# EAGLE design EasyFlybackRev2 (EAGLE 9.6.2)
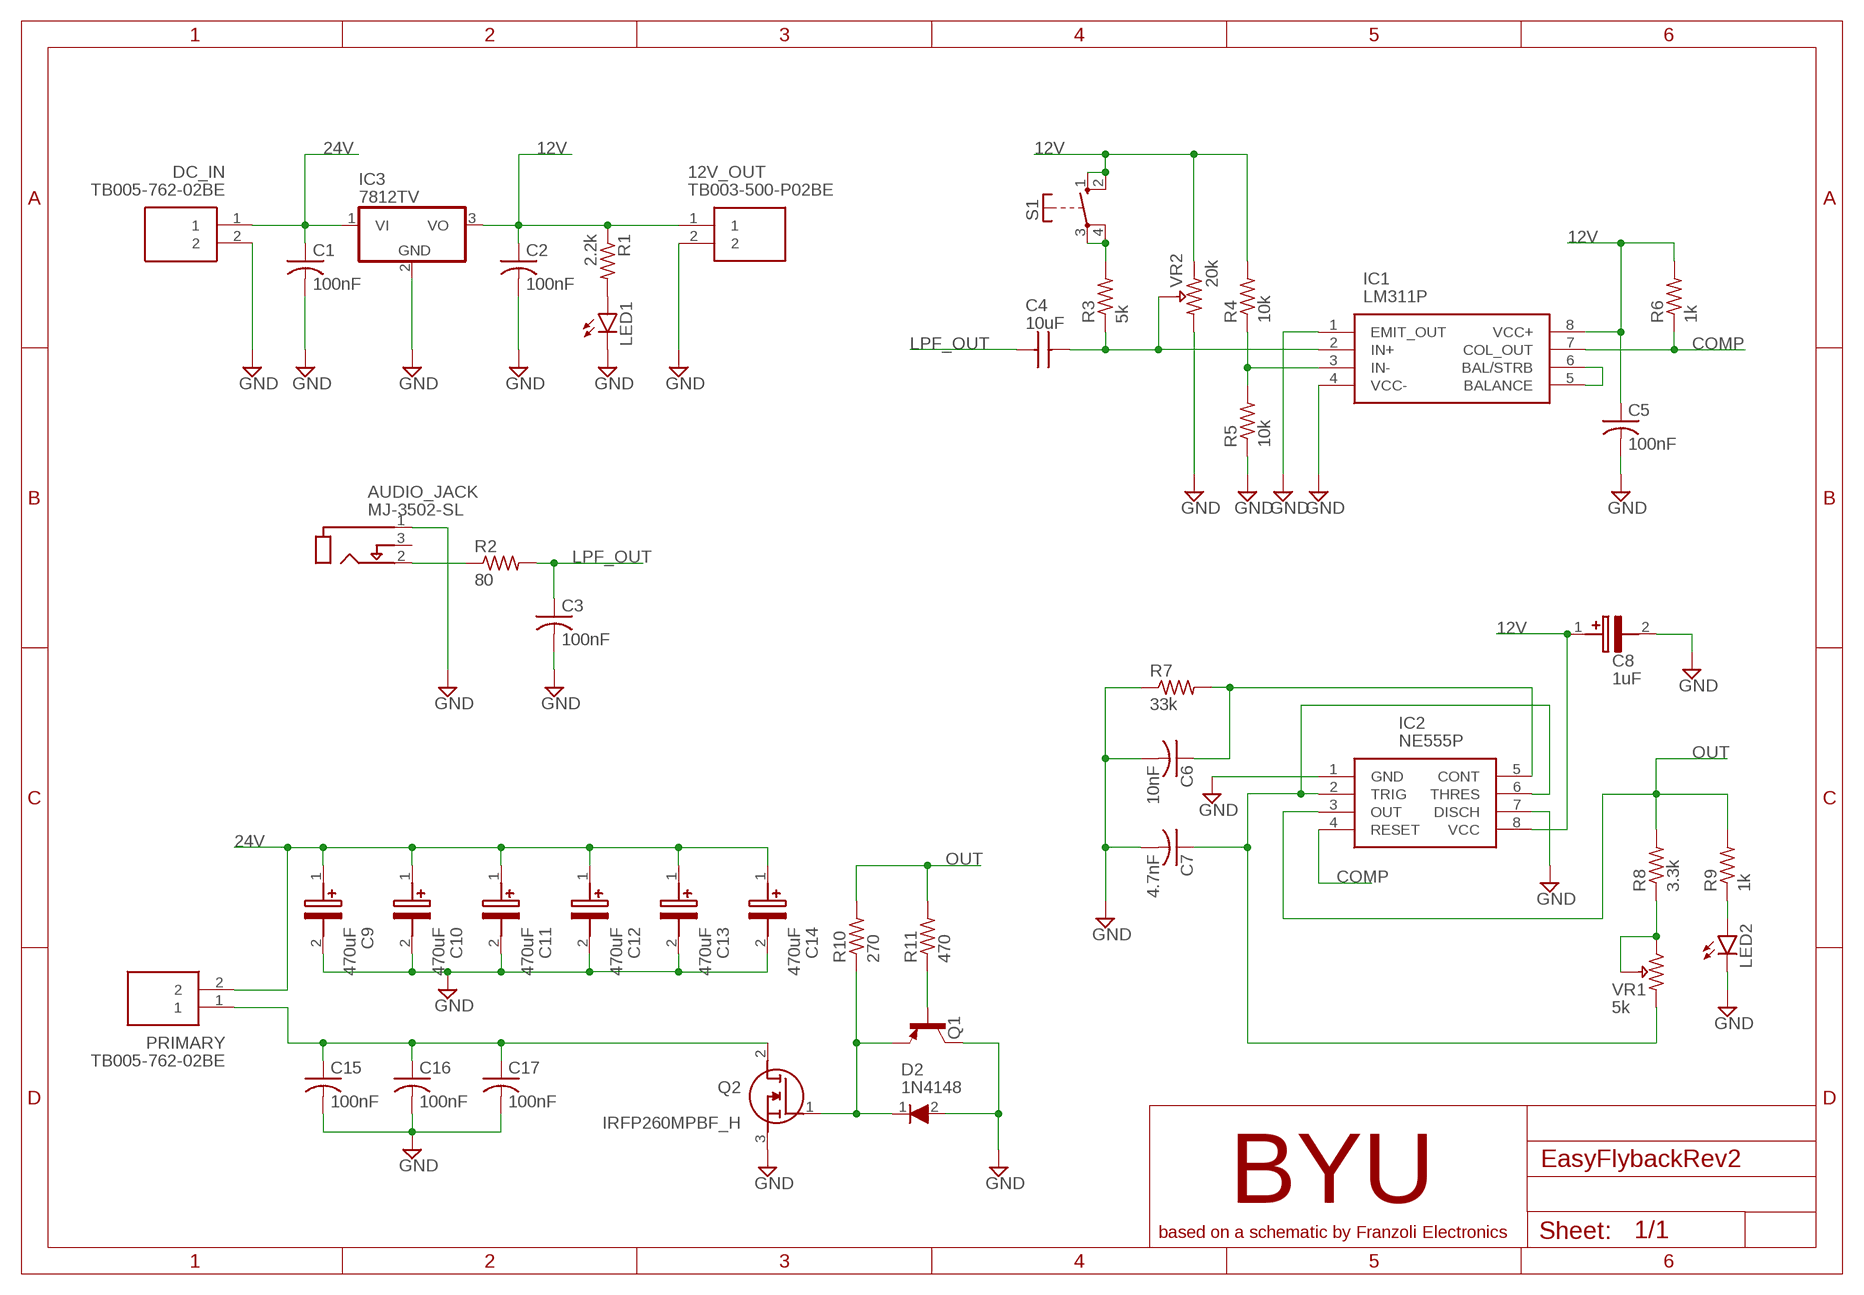
[diagram p0: schematic, sheet 1]

## Parts
12V_OUT  TB003-500-P02BE  [SHDR2W100P0X500_1X2_1000X780X1]
AUDIO_JACK  MJ-3502-SL  [MJ3502-SL]
C1  100nF  C-US025-024X044  [C025-024X044]
C2  100nF  C-US025-024X044  [C025-024X044]
C3  100nF  C-US025-024X044  [C025-024X044]
C4  10uF  RDEC71H106K3K1H03B  [RCE7U2J103J3K1H03B]
C5  100nF  C-US025-024X044  [C025-024X044]
C6  10nF  C-US025-024X044  [C025-024X044]
C7  4.7nF  C-US025-024X044  [C025-024X044]
C8  1uF  TAP105K035SCS  [TAP105K035SCS]
C9  470uF  ECA-1VM471B  [CAPPRD500W65D1000H1700]
C10  470uF  ECA-1VM471B  [CAPPRD500W65D1000H1700]
C11  470uF  ECA-1VM471B  [CAPPRD500W65D1000H1700]
C12  470uF  ECA-1VM471B  [CAPPRD500W65D1000H1700]
C13  470uF  ECA-1VM471B  [CAPPRD500W65D1000H1700]
C14  470uF  ECA-1VM471B  [CAPPRD500W65D1000H1700]
C15  100nF  MKP1G031004D00KSSD  [MKP1G031004D00KSSD]
C16  100nF  MKP1G031004D00KSSD  [MKP1G031004D00KSSD]
C17  100nF  MKP1G031004D00KSSD  [MKP1G031004D00KSSD]
D2  1N4148  [DIOAD1068W53L380D172]
DC_IN  TB005-762-02BE  [TB00576202BE]
IC1  LM311P  [DIP794W53P254L959H508Q8N]
IC2  NE555P  [DIP794W53P254L959H508Q8N]
IC3  7812TV  [TO220V]
LED1  LED5MM  [LED5MM]
LED2  LED5MM  [LED5MM]
PRIMARY  TB005-762-02BE  [TB00576202BE]
Q1  -PNP-TO92-E1  [TO92-E1]
Q2  IRFP260MPBF_H  [TO545P520X1594X2550-3P_H]
R1  2.2k  R-US_0207/10  [0207/10]
R2  80  R-US_0207/10  [0207/10]
R3  5k  R-US_0207/10  [0207/10]
R4  10k  R-US_0207/10  [0207/10]
R5  10k  R-US_0207/10  [0207/10]
R6  1k  R-US_0207/10  [0207/10]
R7  33k  R-US_0207/10  [0207/10]
R8  3.3k  R-US_0207/10  [0207/10]
R9  1k  R-US_0207/10  [0207/10]
R10  270  R-US_0207/10  [0207/10]
R11  470  R-US_0207/10  [0207/10]
S1  DTE6K  [DTE6K]
VR1  5k  PV36W502C01B00  [PV36W502C01B00]
VR2  20k  PV36W502C01B00  [PV36W502C01B00]

## Nets
12V: 12V_OUT.1 C2.1 C5.1 C8.1(+) IC1.8(VCC+) IC2.8(VCC) IC3.3(VO) R1.1 R4.2 R6.2 S1.1(S) S1.2(S) VR2.1(CCW)
24V: C1.1 C9.1(+) C10.1(+) C11.1(+) C12.1(+) C13.1(+) C14.1(+) DC_IN.1 IC3.1(VI) PRIMARY.2
COMP: IC1.7(COL_OUT) IC2.4(RESET) R6.1
GND: 12V_OUT.2 AUDIO_JACK.1 C1.2 C2.2 C3.2 C5.2 C6.2 C7.2 C8.2(-) C9.2(-) C10.2(-) C11.2(-) C12.2(-) C13.2(-) C14.2(-) C15.P$2 C16.P$2 C17.P$2 D2.2(A) DC_IN.2 IC1.1(EMIT_OUT) IC1.4(VCC-) IC2.1(GND) IC2.7(DISCH) IC3.2(GND) LED1.K(C) LED2.K(C) Q1.1(C) Q2.3(S) R5.1 R7.1 VR2.3(CW)
LPF_OUT: C3.1 C4.1 R2.2
N$1: C15.P$1 C16.P$1 C17.P$1 PRIMARY.1 Q2.2(D)
N$2: LED1.A R1.2
N$4: AUDIO_JACK.2 R2.1
N$6: D2.1(K) Q1.3(E) Q2.1(G) R10.1
N$7: R3.2 S1.3(P) S1.4(P)
N$8: IC1.5(BALANCE) IC1.6(BAL/STRB)
N$9: Q1.2(B) R11.1
N$10: C7.1 IC2.2(TRIG) IC2.6(THRES) VR1.3(CW)
N$11: R8.1 VR1.1(CCW) VR1.2(WIPER)
N$12: C6.1 IC2.5(CONT) R7.2
N$13: LED2.A R9.1
N$14: IC1.3(IN-) R4.1 R5.2
N$15: C4.2 IC1.2(IN+) R3.1 VR2.2(WIPER)
OUT: IC2.3(OUT) R8.2 R9.2 R10.2 R11.2
Unconnected: AUDIO_JACK.3

## Notes on the sheet
- BYU
- based on a schematic by Franzoli Electronics

## Library data of the parts
12V_OUT = IMMERSE:TB003-500-P02BE: Fixed Terminal Blocks screw type, 5.00 , horizontal, 2 poles, CUI Blue, Philip's head screw, PCB mount Source: Datasheet <https://datasheet.datasheetarchive.com/originals/distributors/Datasheets_SAMA/d07efe5b59076245584f142a7e2a35cb.pdf>; DESCRIPTION: Fixed Terminal Blocks screw type, 5.00 , horizontal, 2 poles, CUI Blue, Philip's head screw, PCB mount; HEIGHT: 10.3mm; MANUFACTURER_NAME: CUI Inc.; MANUFACTURER_PART_NUMBER: TB003-500-P02BE; MOUSER_PART_NUMBER: 490-TB003-500-P02BE; MOUSER_PRICE-STOCK: https://www.mouser.co.uk/ProductDetail/CUI-Devices/TB003-500-P02BE?qs=vLWxofP3U2yAT9CFQJ%2FCaw%3D%3D
AUDIO_JACK = IMMERSE:MJ-3502-SL: Phone Connectors Audio Jacks Source: Datasheet <https://www.cuidevices.com/product/resource/digikeypdf/mj-3502.pdf>; SPICEPREFIX: J
C1-C3 C5-C7 = rcl:C-US: CAPACITOR, American symbol; SPICEPREFIX: C
C4 = IMMERSE:RDEC71H106K3K1H03B: Multilayer Ceramic Capacitors MLCC - Leaded 10UF 50V 10% 5MM Source: Datasheet <https://psearch.en.murata.com/capacitor/product/RDEC71H106K3K1H03B.html>; DESCRIPTION: Multilayer Ceramic Capacitors MLCC - Leaded 10UF 50V 10% 5MM; HEIGHT: 7.5mm; MANUFACTURER_NAME: Murata Electronics; MANUFACTURER_PART_NUMBER: RDEC71H106K3K1H03B; MOUSER_PART_NUMBER: 81-RDEC71H106K3K1H3B; MOUSER_PRICE-STOCK: https://www.mouser.co.uk/ProductDetail/Murata-Electronics/RDEC71H106K3K1H03B?qs=hNud%2FORuBR3znCHotF4tAw%3D%3D
C8 = IMMERSE:TAP105K035SCS: AVX Tantalum Capacitor 1uF 35V dc Solid +/-10% Tolerance TAP Series Source: Datasheet <https://componentsearchengine.com/Datasheets/1/TAP105K035SCS.pdf>; DESCRIPTION: AVX Tantalum Capacitor 1uF 35V dc Solid +/-10% Tolerance TAP Series; HEIGHT: 7mm; MANUFACTURER_NAME: AVX; MANUFACTURER_PART_NUMBER: TAP105K035SCS; MOUSER_PART_NUMBER: 581-TAP105K035SCS; MOUSER_PRICE-STOCK: https://www.mouser.com/Search/Refine.aspx?Keyword=581-TAP105K035SCS
C9-C14 = IMMERSE:ECA-1VM471B: Aluminum Electrolytic Capacitors - Leaded 470UF 35V ELECT M RADIAL Source: Datasheet <http://industrial.panasonic.com/cdbs/www-data/pdf/RDF0000/ABA0000C1218.pdf>; DESCRIPTION: Aluminum Electrolytic Capacitors - Leaded 470UF 35V ELECT M RADIAL; HEIGHT: 17mm; MANUFACTURER_NAME: Panasonic; MANUFACTURER_PART_NUMBER: ECA-1VM471B; MOUSER_PART_NUMBER: 667-ECA-1VM471B; MOUSER_PRICE-STOCK: https://www.mouser.co.uk/ProductDetail/Panasonic/ECA-1VM471B?qs=HDhZcL5REiYtj3pihfsTHg%3D%3D
C15-C17 = IMMERSE:MKP1G031004D00KSSD
D2 = IMMERSE:1N4148: Small Signal Diode, 100V 0.3A 2-Pin DO35 Source: Datasheet; DESCRIPTION: Small Signal Diode, 100V 0.3A 2-Pin DO35; HEIGHT: mm; MANUFACTURER_NAME: onsemi; MANUFACTURER_PART_NUMBER: 1N4148; MOUSER_PART_NUMBER: 512-1N4148; MOUSER_PRICE-STOCK: https://www.mouser.co.uk/ProductDetail/ON-Semiconductor-Fairchild/1N4148?qs=i4Fj9T%2FoRm8RMUhj5DeFQg%3D%3D
DC_IN PRIMARY = IMMERSE:TB005-762-02BE: Fixed Terminal Blocks screw type, 7.62 , horizontal, 2 poles, CUI Blue, slotted screw, PCB mount Source: Datasheet <https://componentsearchengine.com/Datasheets/1/TB005-762-02BE.pdf>; DESCRIPTION: Fixed Terminal Blocks screw type, 7.62 , horizontal, 2 poles, CUI Blue, slotted screw, PCB mount; HEIGHT: 21.7mm; MANUFACTURER_NAME: CUI Inc.; MANUFACTURER_PART_NUMBER: TB005-762-02BE; MOUSER_PART_NUMBER: 490-TB005-762-02BE; MOUSER_PRICE-STOCK: https://www.mouser.co.uk/ProductDetail/CUI-Devices/TB005-762-02BE?qs=vLWxofP3U2zXv1H2wuShow%3D%3D
IC1 = IMMERSE:LM311P: Single comparator,LM311P 165ns DIP8 LM311P, Comparator Open Collector/Emitter 0.165us 12 V, 15 V, 18 V, 24 V, 28 V, 5 V, 9 V 8-Pin PDIP Source: Datasheet <http://www.ti.com/lit/ds/symlink/lm311.pdf>; DESCRIPTION: Single comparator,LM311P 165ns DIP8 LM311P, Comparator Open Collector/Emitter 0.165us 12 V, 15 V, 18 V, 24 V, 28 V, 5 V, 9 V 8-Pin PDIP; HEIGHT: 5.08mm; MANUFACTURER_NAME: Texas Instruments; MANUFACTURER_PART_NUMBER: LM311P; MOUSER_PART_NUMBER: 595-LM311P; MOUSER_PRICE-STOCK: https://www.mouser.co.uk/ProductDetail/Texas-Instruments/LM311P?qs=0OT4q4QBUTKsKDe9sMZxLw%3D%3D
IC2 = IMMERSE:NE555P: Precision timer,NE555P 0.5MHz DIL8 Texas Instruments NE555P, Precision Timer, 4.5 16 V, 8-Pin PDIP Source: Datasheet <http://www.ti.com/lit/ds/symlink/ne555.pdf>; DESCRIPTION: Precision timer,NE555P 0.5MHz DIL8 Texas Instruments NE555P, Precision Timer, 4.5 16 V, 8-Pin PDIP; HEIGHT: 5.08mm; MANUFACTURER_NAME: Texas Instruments; MANUFACTURER_PART_NUMBER: NE555P; MOUSER_PART_NUMBER: 595-NE555P; MOUSER_PRICE-STOCK: https://www.mouser.co.uk/ProductDetail/Texas-Instruments/NE555P?qs=rkhjVJ6%2F3EIf4CWgjIKuKQ%3D%3D
IC3 = linear:78*: Positive VOLTAGE REGULATOR Source: http://cache.national.com/ds/LM/LM78L05.pdf http://www.fairchildsemi.com/ds/LM/LM7805.pdf
LED1 LED2 = led:LED: LED OSRAM: - CHIPLED LG R971, LG N971, LY N971, LG Q971, LY Q971, LO R971, LY R971 LH N974, LH R974 LS Q976, LO Q976, LY Q976 LO Q996 - Hyper CHIPLED LW Q18S LB Q993, LB Q99A, LB R99A - SideLED LS A670, LO A670, LY A670, LG A670, LP A670 LB A673, LV A673, LT A673, LW A673 LH A674 LY A675 LS A676, LA A676, LO A676, LY A676, LW A676 LS A679, LY A679, LG A679 - Hyper Micro SIDELED® LS Y876, LA Y876, LO Y876, LY Y876 LT Y87S - SmartLED LW L88C, LW L88S LB L89C, LB L89S, LG L890 LS L89K, LO L89K, LY L89K LS L896, LA L896, LO L896, LY L896 - TOPLED LS T670, LO T670, LY T670, LG T670, LP T670 LSG T670, LSP T670, LSY T670, LOP T670, LYG T670 LG T671, LOG T671, LSG T671 LB T673, LV T673, LT T673, LW T673 LH T674 LS T676, LA T676, LO T676, LY T676, LB T676, LH T676, LSB T676, LW T676 LB T67C, LV T67C, LT T67C, LS T67K, LO T67K, LY T67K, LW E67C LS E67B, LA E67B, LO E67B, LY E67B, LB E67C, LV E67C, LT E67C LW T67C LS T679, LY T679, LG T679 LS T770, LO T770, LY T770, LG T770, LP T770 LB T773, LV T773, LT T773, LW T773 LH T774 LS E675, LA E675, LY E675, LS T675 LS T776, LA T776, LO T776, LY T776, LB T776 LHGB T686 LT T68C, LB T68C - Hyper Mini TOPLED® LB M676 - Mini TOPLED Santana® LG M470 LS M47K, LO M47K, LY M47K Source: http://www.osram.convergy.de LUXEON: - LUMILED® LXK2-PW12-R00, LXK2-PW12-S00, LXK2-PW14-U00, LXK2-PW14-V00 LXK2-PM12-R00, LXK2-PM12-S00, LXK2-PM14-U00 LXK2-PE12-Q00, LXK2-PE12-R00, LXK2-PE12-S00, LXK2-PE14-T00, LXK2-PE14-U00 LXK2-PB12-K00, LXK2-PB12-L00, LXK2-PB12-M00, LXK2-PB14-N00, LXK2-PB14-P00, LXK2-PB14-Q00 LXK2-PR12-L00, LXK2-PR12-M00, LXK2-PR14-Q00, LXK2-PR14-R00 LXK2-PD12-Q00, LXK2-PD12-R00, LXK2-PD12-S00 LXK2-PH12-R00, LXK2-PH12-S00 LXK2-PL12-P00, LXK2-PL12-Q00, LXK2-PL12-R00 Source: www.luxeon.com KINGBRIGHT: KA-3528ASYC Source: www.kingbright.com
Q1 = transistor:*-PNP-: PNP Transistror
Q2 = IMMERSE:IRFP260MPBF_H: Infineon IRFP260MPBF N-Channel MOSFET, 50 A, 200 V HEXFET, 3-Pin TO-247AC Source: Datasheet <https://www.infineon.com/dgdl/irfp260mpbf.pdf?fileId=5546d462533600a40153562894e91fe0>; DESCRIPTION: Infineon IRFP260MPBF N-Channel MOSFET, 50 A, 200 V HEXFET, 3-Pin TO-247AC; HEIGHT: 5.2mm; MANUFACTURER_NAME: Infineon; MANUFACTURER_PART_NUMBER: IRFP260MPBF; MOUSER_PART_NUMBER: 942-IRFP260MPBF; MOUSER_PRICE-STOCK: https://www.mouser.co.uk/ProductDetail/Infineon-IR/IRFP260MPBF?qs=9%252BKlkBgLFf3VoUn7jHVwig%3D%3D
R1-R11 = rcl:R-US_: RESISTOR, American symbol; SPICEPREFIX: R
S1 = switch-misc:DT: ITT SWITCH
VR1 VR2 = IMMERSE:PV36W502C01B00: Res Cermet Trimmer 5K Ohm 10% 0.5W(1/2W) 25(Elec)Turns 2.19mm (9.53 X 4.83 X 10.55mm) Pin Thru-Hole Tube Source: Datasheet; DESCRIPTION: Res Cermet Trimmer 5K Ohm 10% 0.5W(1/2W) 25(Elec)Turns 2.19mm (9.53 X 4.83 X 10.55mm) Pin Thru-Hole Tube; HEIGHT: 11.55mm; MANUFACTURER_NAME: Bourns; MANUFACTURER_PART_NUMBER: PV36W502C01B00; MOUSER_PART_NUMBER: 81-PV36W502C01B00; MOUSER_PRICE-STOCK: https://www.mouser.co.uk/ProductDetail/Bourns/PV36W502C01B00?qs=BqPwLKJeIrffwfpi4cR%2Fyg%3D%3D

## Board
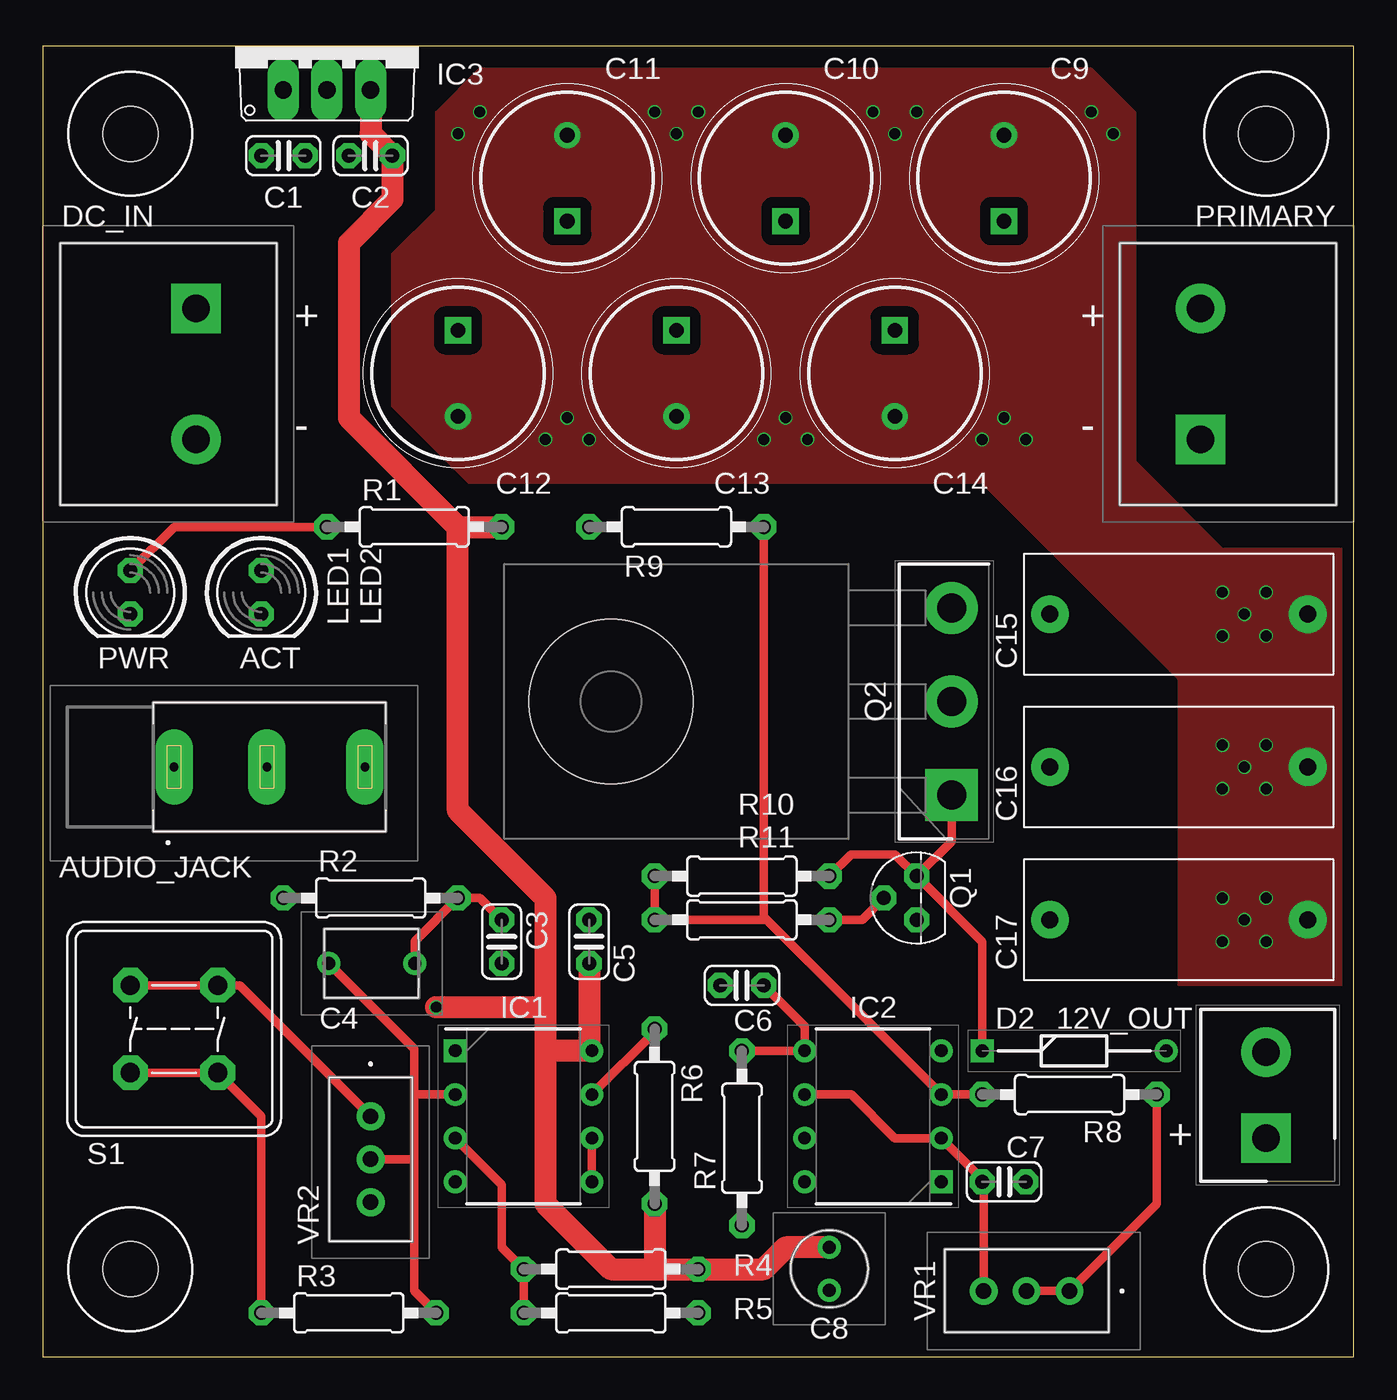
[diagram p1: board, top side]
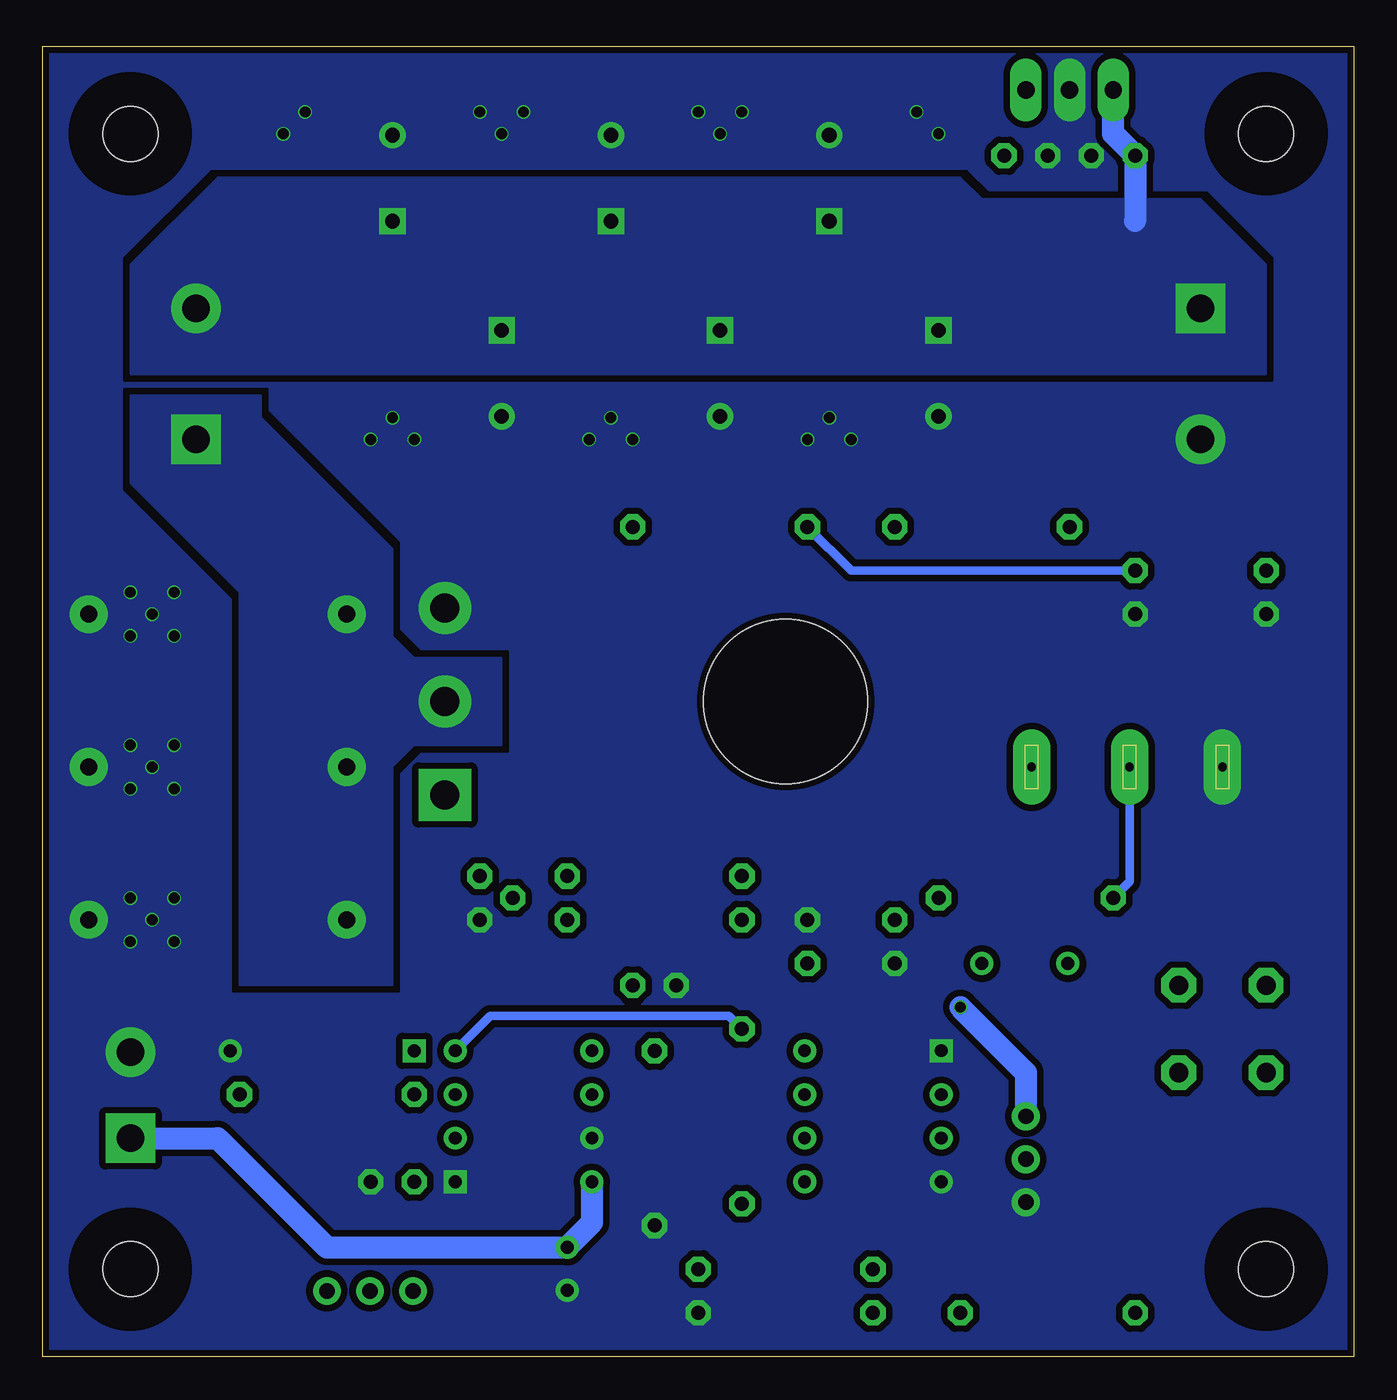
[diagram p2: board, bottom side, seen from below]

Size 76.2 x 76.2 mm. Coordinates in mm from the lower left corner, seen from the top.
Outline: 0,0 76.2,0 76.2,76.2 0,76.2 0,0
Copper layers (1*16): Top 0.035mm / dielectric 1.6mm / Bottom 0.035mm
Design rules "jlcpcb-2layers": minimum track width 5mil, minimum drill 0.3mm, track to track 5mil, track to pad 5mil, pad to pad 5mil, via to via 5mil, smd to smd 5mil, copper to edge 0.2mm, drill to drill 6mil, minimum pad ring 10mil, minimum via ring 3mil, stop-mask expansion 4mil, vias tented up to drill 0mil, thermal gap 10mil
Holes 3.17 mm at 5.08,71.12 71.12,71.12 71.12,5.08 5.08,5.08
Holes 9.53 mm at 33.02,38.1
bRestrict: area 1.9,67.9 to 8.3,74.3; area 67.9,67.9 to 74.3,74.3; area 67.9,1.9 to 74.3,8.3; area 1.9,1.9 to 8.3,8.3

### Footprints (pad centres in the part's own frame; a part is rotated, then mirrored left to right if it is on the bottom)
SHDR2W100P0X500_1X2_1000X780X1 = drill 1.6 pad 2.4 square: 1 0,0 | drill 1.6 pad 2.4: 2 5,0
MJ3502-SL = drill 0.5 pad 2.184 long: 1 0,0; 2 5.4,0; 3 11.1,0
C025-024X044 = drill 0.813 octagon: 1 -1.27,0; 2 1.27,0
RCE7U2J103J3K1H03B = drill 0.75 pad 1.2: 1 -0.02,0; 2 4.98,0
TAP105K035SCS = drill 0.75 pad 1.2: 1 0,0; 2 2.5,0
CAPPRD500W65D1000H1700 = drill 0.85 pad 1.275 square: 1 0,0 | drill 0.85 pad 1.275: 2 5,0
MKP1G031004D00KSSD = drill 1 pad 2.184: P$1 -7.5,0; P$2 7.5,0
DIOAD1068W53L380D172 = drill 0.75 pad 1.15 square: 1 0,0 | drill 0.75 pad 1.15: 2 10.7,0
TB00576202BE = drill 1.6 pad 2.4 square: 1 0,0 | drill 1.6 pad 2.4: 2 7.62,0
DIP794W53P254L959H508Q8N = drill 0.73 pad 1.13 square: 1 -3.97,3.81 | drill 0.73 pad 1.13: 2 -3.97,1.27; 3 -3.97,-1.27; 4 -3.97,-3.81; 5 3.97,-3.81; 6 3.97,-1.27; 7 3.97,1.27; 8 3.97,3.81
TO220V = drill 1.016 long: 1 -2.54,-2.54; 2 0,-2.54; 3 2.54,-2.54
LED5MM = drill 0.813 octagon: A -1.27,0; K 1.27,0
TO92-E1 = drill 0.813 octagon: 1 -1.27,0; 2 0,1.905; 3 1.27,0
TO545P520X1594X2550-3P_H = drill 1.69 pad 2.535 square: 1 -5.44,0 | drill 1.69 pad 2.535: 2 0,0; 3 5.44,0
0207/10 = drill 0.813 octagon: 1 -5.08,0; 2 5.08,0
DTE6K = drill 1.118 octagon: 1 -2.54,2.54; 2 2.54,2.54; 3 2.54,-2.54; 4 -2.54,-2.54
PV36W502C01B00 = drill 0.9 pad 1.4: 1 0,0; 2 0,2.5; 3 0,5

### Placement (x,y rotation side)
12V_OUT  71.12,12.7 90 top
AUDIO_JACK  7.62,34.29 0 top
C1  13.97,69.85 0 top
C2  19.05,69.85 180 top
C3  26.67,24.13 270 top
C4  21.59,22.86 180 top
C5  31.75,24.13 90 top
C6  40.64,21.59 180 top
C7  55.88,10.16 0 top
C8  45.72,6.35 270 top
C9  55.88,66.04 90 top
C10  43.18,66.04 90 top
C11  30.48,66.04 90 top
C12  24.13,59.69 270 top
C13  36.83,59.69 270 top
C14  49.53,59.69 270 top
C15  66.04,43.18 0 top
C16  66.04,34.29 0 top
C17  66.04,25.4 0 top
D2  54.61,17.78 0 top
DC_IN  8.89,60.96 270 top
IC1  27.94,13.97 0 top
IC2  48.26,13.97 180 top
IC3  16.51,76.2 0 top
LED1  5.08,44.45 270 top
LED2  12.7,44.45 270 top
PRIMARY  67.31,53.34 90 top
Q1  50.8,26.67 90 top
Q2  52.83,38.1 90 top
R1  21.59,48.26 180 top
R2  19.05,26.67 0 top
R3  17.78,2.54 180 top
R4  33.02,5.08 0 top
R5  33.02,2.54 180 top
R6  35.56,13.97 270 top
R7  40.64,12.7 90 top
R8  59.69,15.24 180 top
R9  36.83,48.26 0 top
R10  40.64,27.94 180 top
R11  40.64,25.4 180 top
S1  7.62,19.05 0 top
VR1  59.69,3.81 90 top
VR2  19.05,13.97 180 top

### Tracks (layer width: path | path; a pad name or v marks a point on that pad's centre or on a via)
12V  (via drill 0.64)
  Top 0.508: S1.1 S1.2 11.43,21.59 VR2.1
  Top 1.27: 35.56,5.08 33.02,5.08 29.21,8.89 29.21,17.78 | 35.56,5.08 R4.2 41.91,5.08 43.18,6.35 C8.1 | 29.21,20.32 29.21,26.67 24.13,31.75 24.13,48.26 | 29.21,20.32 29.21,17.78 | 29.21,17.78 IC1.8 31.75,17.94 C5.1 | 29.21,20.32 v22.86,20.32 | IC3.3 19.05,71.12 C2.1 20.32,67.31 17.78,64.77 17.78,54.61 24.13,48.26 | R6.2 35.56,5.08 | 24.13,48.26 R1.1
  Bottom 1.27: v22.86,20.32 19.05,16.51 VR2.1 | 12V_OUT.1 66.04,12.7 59.69,6.35 C8.1 44.29,7.78 IC2.8
24V
  Bottom 1.27: 12.7,66.04 C1.1 13.97,71.12 IC3.1
  pour Bottom (isolate 0.635, no thermals): 5.08,57.15 5.08,63.5 8.89,67.31 21.59,67.31 22.86,68.58 66.04,68.58 71.12,63.5 71.12,57.15
COMP
  Top 0.508: IC1.7 35.56,18.89 R6.1
  Bottom 0.508: IC2.4 50.2,19.81 36.32,19.81 R6.1
GND  (via drill 0.64)
  other vias: 35.56,72.39 36.83,71.12 38.1,72.39 48.26,72.39 49.53,71.12 50.8,72.39 29.21,53.34 30.48,54.61 31.75,53.34 41.91,53.34 43.18,54.61 44.45,53.34 54.61,53.34 55.88,54.61 57.15,53.34 71.12,41.91 69.85,43.18 71.12,44.45 71.12,33.02 69.85,34.29 71.12,35.56 71.12,24.13 69.85,25.4 71.12,26.67 60.96,72.39 62.23,71.12 24.13,71.12 25.4,72.39 68.58,44.45 68.58,41.91 68.58,35.56 68.58,33.02 68.58,26.67 68.58,24.13
  pour Top (isolate 0.635, no thermals): 20.32,55.24 20.32,64.14 22.86,66.67 22.86,72.39 25.4,74.93 60.96,74.93 63.5,72.39 63.5,52.07 68.58,46.99 76.2,46.99 76.2,21.59 66.04,21.59 66.04,39.37 54.61,50.8 24.77,50.8
  pour Bottom (isolate 0.381, rank 2, no thermals): -2.54,78.74 78.74,78.74 78.74,-2.54 -2.54,-2.54
LPF_OUT
  Top 0.508: C4.1 21.61,24.15 R2.2 25.4,26.67 C3.1
N$1
  pour Bottom (isolate 0.635, no thermals): 55.88,46.99 55.88,21.59 64.77,21.59 64.77,46.99
  pour Bottom (isolate 0.635, no thermals): 50.8,40.64 53.34,40.64 54.61,40.64 55.88,41.91 55.88,34.29 54.61,35.56 49.53,35.56 49.53,40.64
  pour Bottom (isolate 0.635, no thermals): 71.12,55.88 71.12,50.8 64.77,44.45 64.77,46.99 55.88,46.99 63.5,54.61 63.5,55.88
N$2
  Top 0.508: R1.2 7.62,48.26 LED1.A
N$4
  Bottom 0.508: AUDIO_JACK.2 13.02,27.62 R2.1
N$6
  Top 0.508: Q1.3 52.83,29.97 Q2.1 | Q1.3 49.53,29.21 46.99,29.21 R10.1 | Q1.3 54.61,24.13 D2.1
N$7
  Top 0.508: S1.4 S1.3 12.7,13.97 R3.2
N$8
  Top 0.508: IC1.5 IC1.6
N$9
  Top 0.508: R11.1 47.62,25.4 Q1.2
N$10
  Top 0.508: IC2.6 46.99,15.24 49.53,12.7 IC2.2 54.61,10.32 C7.1 54.69,10.08 VR1.3
N$11
  Top 0.508: R8.1 64.77,8.89 VR1.1 VR1.2
N$12
  Top 0.508: R7.2 IC2.5 44.29,19.21 C6.1
N$13
  Bottom 0.508: LED2.A 29.21,45.72 R9.1
N$14
  Top 0.508: R5.2 R4.1 26.67,6.35 26.67,10 IC1.3
N$15
  Top 0.508: VR2.2 21.59,11.47 | 21.59,11.47 21.59,15.24 | 21.59,11.47 21.59,3.81 R3.1 | IC1.2 21.59,15.24 | 21.59,15.24 21.59,17.88 C4.2
OUT
  Top 0.508: R10.2 R11.2 42.07,25.4 | R8.2 IC2.3 42.07,25.4 | 42.07,25.4 41.91,25.56 R9.2

### Text on the board
tPlace: + | + | - | - | PWR | ACT | +